# EAGLE design rpi64 (EAGLE 7.1.0)
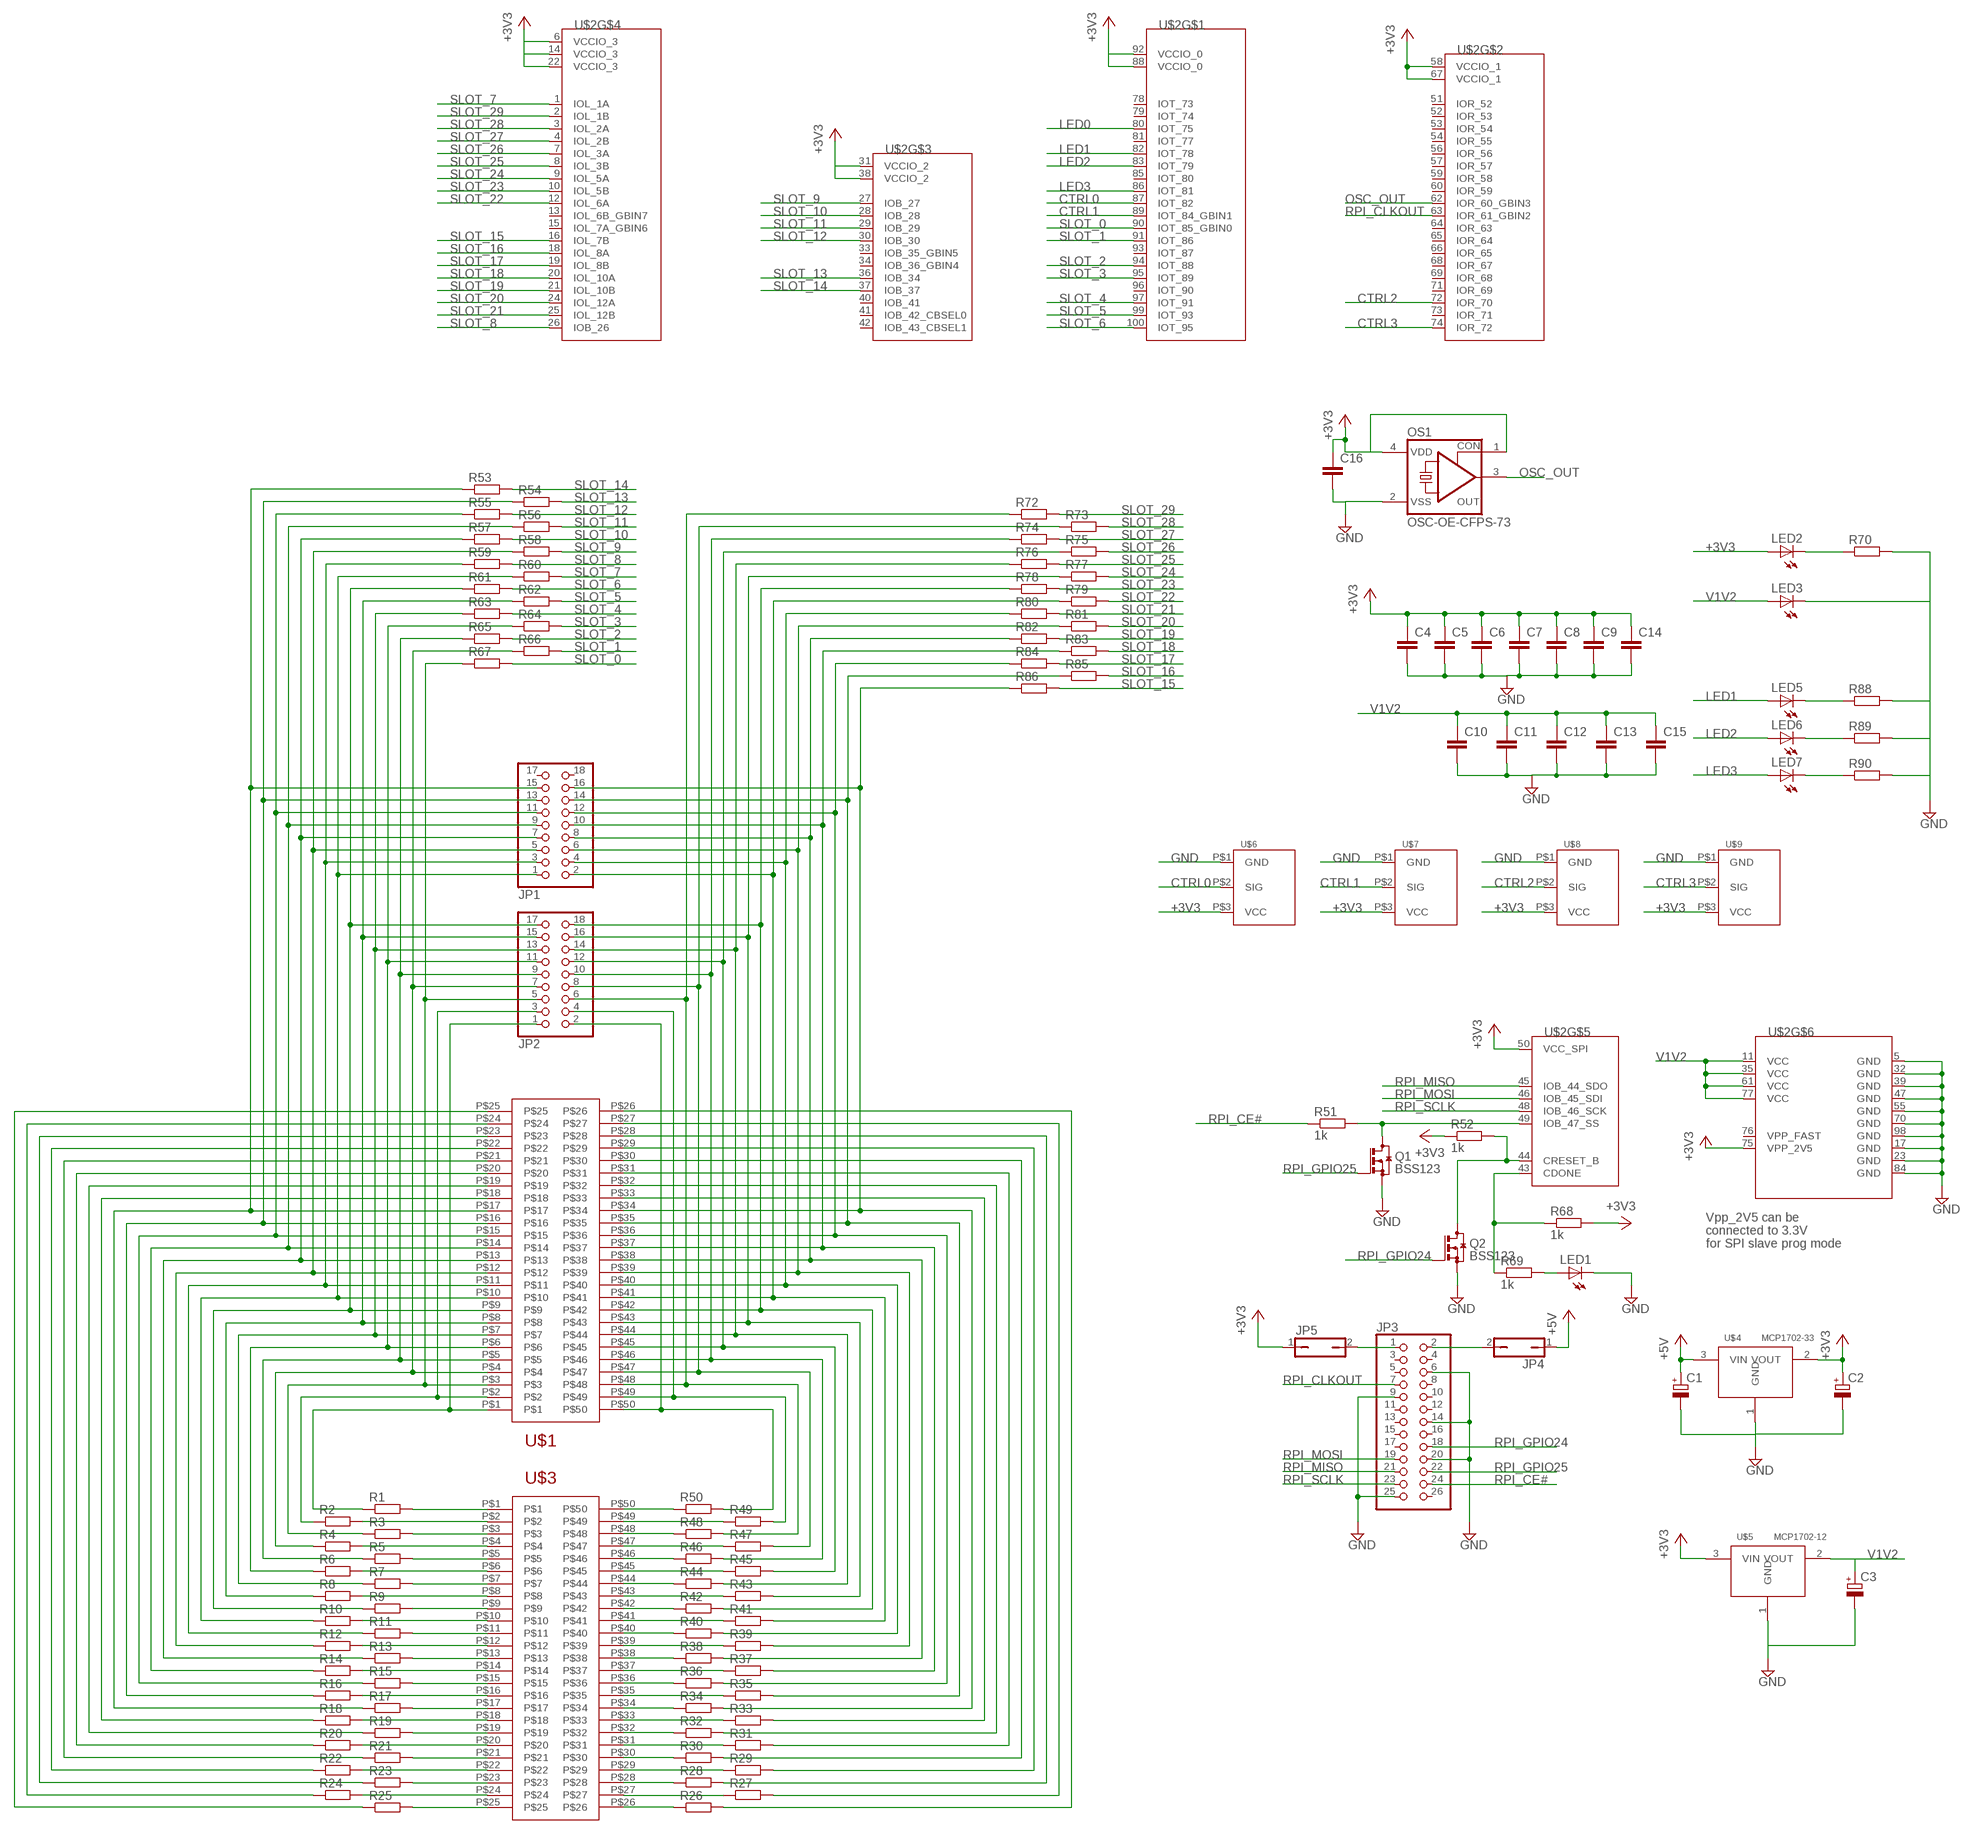
[diagram p0: schematic, sheet 1]

## Parts
C1  CPOL-EUR/2012-12R  [R/2012-12R]
C2  CPOL-EUR/2012-12R  [R/2012-12R]
C3  CPOL-EUR/2012-12R  [R/2012-12R]
C4  C-EUC0805  [C0805]
C5  C-EUC0805  [C0805]
C6  C-EUC0805  [C0805]
C7  C-EUC0805  [C0805]
C8  C-EUC0805  [C0805]
C9  C-EUC0805  [C0805]
C10  C-EUC0805  [C0805]
C11  C-EUC0805  [C0805]
C12  C-EUC0805  [C0805]
C13  C-EUC0805  [C0805]
C14  C-EUC0805  [C0805]
C15  C-EUC0805  [C0805]
C16  C-EUC0805  [C0805]
JP1  PINHD-2X9  [2X09]
JP2  PINHD-2X9  [2X09]
JP3  PINHD-2X13  [2X13]
JP4  JP1Q  [JP1]
JP5  JP1Q  [JP1]
LED1  LEDCHIPLED_0603  [CHIPLED_0603]
LED2  LEDCHIPLED_0603  [CHIPLED_0603]
LED3  LEDCHIPLED_0603  [CHIPLED_0603]
LED5  LEDCHIPLED_0603  [CHIPLED_0603]
LED6  LEDCHIPLED_0603  [CHIPLED_0603]
LED7  LEDCHIPLED_0603  [CHIPLED_0603]
OS1  OSC-OE-CFPS-73  [7.2X5.2-4-PAD]
Q1  BSS123  [SOT23]
Q2  BSS123  [SOT23]
R1  R-EU_R0603  [R0603]
R2  R-EU_R0603  [R0603]
R3  R-EU_R0603  [R0603]
R4  R-EU_R0603  [R0603]
R5  R-EU_R0603  [R0603]
R6  R-EU_R0603  [R0603]
R7  R-EU_R0603  [R0603]
R8  R-EU_R0603  [R0603]
R9  R-EU_R0603  [R0603]
R10  R-EU_R0603  [R0603]
R11  R-EU_R0603  [R0603]
R12  R-EU_R0603  [R0603]
R13  R-EU_R0603  [R0603]
R14  R-EU_R0603  [R0603]
R15  R-EU_R0603  [R0603]
R16  R-EU_R0603  [R0603]
R17  R-EU_R0603  [R0603]
R18  R-EU_R0603  [R0603]
R19  R-EU_R0603  [R0603]
R20  R-EU_R0603  [R0603]
R21  R-EU_R0603  [R0603]
R22  R-EU_R0603  [R0603]
R23  R-EU_R0603  [R0603]
R24  R-EU_R0603  [R0603]
R25  R-EU_R0603  [R0603]
R26  R-EU_R0603  [R0603]
R27  R-EU_R0603  [R0603]
R28  R-EU_R0603  [R0603]
R29  R-EU_R0603  [R0603]
R30  R-EU_R0603  [R0603]
R31  R-EU_R0603  [R0603]
R32  R-EU_R0603  [R0603]
R33  R-EU_R0603  [R0603]
R34  R-EU_R0603  [R0603]
R35  R-EU_R0603  [R0603]
R36  R-EU_R0603  [R0603]
R37  R-EU_R0603  [R0603]
R38  R-EU_R0603  [R0603]
R39  R-EU_R0603  [R0603]
R40  R-EU_R0603  [R0603]
R41  R-EU_R0603  [R0603]
R42  R-EU_R0603  [R0603]
R43  R-EU_R0603  [R0603]
R44  R-EU_R0603  [R0603]
R45  R-EU_R0603  [R0603]
R46  R-EU_R0603  [R0603]
R47  R-EU_R0603  [R0603]
R48  R-EU_R0603  [R0603]
R49  R-EU_R0603  [R0603]
R50  R-EU_R0603  [R0603]
R51  1k  R-EU_R0603  [R0603]
R52  1k  R-EU_R0603  [R0603]
R53  R-EU_R0603  [R0603]
R54  R-EU_R0603  [R0603]
R55  R-EU_R0603  [R0603]
R56  R-EU_R0603  [R0603]
R57  R-EU_R0603  [R0603]
R58  R-EU_R0603  [R0603]
R59  R-EU_R0603  [R0603]
R60  R-EU_R0603  [R0603]
R61  R-EU_R0603  [R0603]
R62  R-EU_R0603  [R0603]
R63  R-EU_R0603  [R0603]
R64  R-EU_R0603  [R0603]
R65  R-EU_R0603  [R0603]
R66  R-EU_R0603  [R0603]
R67  R-EU_R0603  [R0603]
R68  1k  R-EU_R0603  [R0603]
R69  1k  R-EU_R0603  [R0603]
R70  R-EU_R0603  [R0603]
R72  R-EU_R0603  [R0603]
R73  R-EU_R0603  [R0603]
R74  R-EU_R0603  [R0603]
R75  R-EU_R0603  [R0603]
R76  R-EU_R0603  [R0603]
R77  R-EU_R0603  [R0603]
R78  R-EU_R0603  [R0603]
R79  R-EU_R0603  [R0603]
R80  R-EU_R0603  [R0603]
R81  R-EU_R0603  [R0603]
R82  R-EU_R0603  [R0603]
R83  R-EU_R0603  [R0603]
R84  R-EU_R0603  [R0603]
R85  R-EU_R0603  [R0603]
R86  R-EU_R0603  [R0603]
R88  R-EU_R0603  [R0603]
R89  R-EU_R0603  [R0603]
R90  R-EU_R0603  [R0603]
U$1  5530843-5  [5530843-3]
U$2  ICE40HX1KVQ100  [VQ100]
U$3  EDGE50  [EDGE50]
U$4  MCP1702-33  MCP1702  [SOT23A]
U$5  MCP1702-12  MCP1702  [SOT23A]
U$6  N64_CONTROLER  [N64_CONTROLER]
U$7  N64_CONTROLER  [N64_CONTROLER]
U$8  N64_CONTROLER  [N64_CONTROLER]
U$9  N64_CONTROLER  [N64_CONTROLER]

## Nets
+3V3: C2.+ C4.1 C5.1 C6.1 C7.1 C8.1 C9.1 C14.1 C16.1 JP5.1 LED2.A OS1.1(CON) OS1.4(VDD) R52.1 R68.2 U$2.6(VCCIO_3) U$2.14(VCCIO_3) U$2.22(VCCIO_3) U$2.31(VCCIO_2) U$2.38(VCCIO_2) U$2.50(VCC_SPI) U$2.58(VCCIO_1) U$2.67(VCCIO_1) U$2.75(VPP_2V5) U$2.88(VCCIO_0) U$2.92(VCCIO_0) U$4.2(VOUT) U$5.3(VIN) U$6.P$3(VCC) U$7.P$3(VCC) U$8.P$3(VCC) U$9.P$3(VCC)
+5V: C1.+ JP4.1 U$4.3(VIN)
CTRL0: U$2.87(IOT_82) U$6.P$2(SIG)
CTRL1: U$2.89(IOT_84_GBIN1) U$7.P$2(SIG)
CTRL2: U$2.72(IOR_70) U$8.P$2(SIG)
CTRL3: U$2.74(IOR_72) U$9.P$2(SIG)
GND: C1.- C2.- C3.- C4.2 C5.2 C6.2 C7.2 C8.2 C9.2 C10.2 C11.2 C12.2 C13.2 C14.2 C15.2 C16.2 JP3.6 JP3.9 JP3.14 JP3.20 JP3.25 LED1.C LED3.C OS1.2(VSS) Q1.2(S) Q2.2(S) R70.2 R88.2 R89.2 R90.2 U$2.5(GND) U$2.17(GND) U$2.23(GND) U$2.32(GND) U$2.39(GND) U$2.47(GND) U$2.55(GND) U$2.70(GND) U$2.84(GND) U$2.98(GND) U$4.1(GND) U$5.1(GND) U$6.P$1(GND) U$7.P$1(GND) U$8.P$1(GND) U$9.P$1(GND)
LED0: U$2.80(IOT_75)
LED1: LED5.A U$2.82(IOT_78)
LED2: LED6.A U$2.83(IOT_79)
LED3: LED7.A U$2.86(IOT_81)
N$1: R1.2 U$3.P$1
N$2: R2.2 U$3.P$2
N$3: R3.2 U$3.P$3
N$4: R4.2 U$3.P$4
N$5: R5.2 U$3.P$5
N$6: R6.2 U$3.P$6
N$7: R7.2 U$3.P$7
N$8: R8.2 U$3.P$8
N$9: R9.2 U$3.P$9
N$10: R10.2 U$3.P$10
N$11: R11.2 U$3.P$11
N$12: R12.2 U$3.P$12
N$13: R13.2 U$3.P$13
N$14: R14.2 U$3.P$14
N$15: R15.2 U$3.P$15
N$16: R16.2 U$3.P$16
N$17: R17.2 U$3.P$17
N$18: R18.2 U$3.P$18
N$19: R19.2 U$3.P$19
N$20: R20.2 U$3.P$20
N$21: R21.2 U$3.P$21
N$22: R22.2 U$3.P$22
N$23: R23.2 U$3.P$23
N$24: R24.2 U$3.P$24
N$25: R25.2 U$3.P$25
N$26: R26.1 U$3.P$26
N$27: R27.1 U$3.P$27
N$28: R28.1 U$3.P$28
N$29: R29.1 U$3.P$29
N$30: R30.1 U$3.P$30
N$31: R31.1 U$3.P$31
N$32: R32.1 U$3.P$32
N$33: R33.1 U$3.P$33
N$34: R34.1 U$3.P$34
N$35: R35.1 U$3.P$35
N$36: R36.1 U$3.P$36
N$37: R37.1 U$3.P$37
N$38: R38.1 U$3.P$38
N$39: R39.1 U$3.P$39
N$40: R40.1 U$3.P$40
N$41: R41.1 U$3.P$41
N$42: R42.1 U$3.P$42
N$43: R43.1 U$3.P$43
N$44: R44.1 U$3.P$44
N$45: R45.1 U$3.P$45
N$46: R46.1 U$3.P$46
N$47: R47.1 U$3.P$47
N$48: R48.1 U$3.P$48
N$49: R49.1 U$3.P$49
N$50: R50.1 U$3.P$50
N$51: JP2.1 R1.1 U$1.P$1
N$52: JP2.3 R2.1 U$1.P$2
N$53: JP2.5 R3.1 R67.1 U$1.P$3
N$54: JP2.7 R4.1 R66.1 U$1.P$4
N$55: JP2.9 R5.1 R65.1 U$1.P$5
N$56: JP2.11 R6.1 R64.1 U$1.P$6
N$57: JP2.13 R7.1 R63.1 U$1.P$7
N$58: JP2.15 R8.1 R62.1 U$1.P$8
N$59: JP2.17 R9.1 R61.1 U$1.P$9
N$60: JP1.1 R10.1 R60.1 U$1.P$10
N$61: JP1.3 R11.1 R59.1 U$1.P$11
N$62: JP1.5 R12.1 R58.1 U$1.P$12
N$63: JP1.7 R13.1 R57.1 U$1.P$13
N$64: JP1.9 R14.1 R56.1 U$1.P$14
N$65: JP1.11 R15.1 R55.1 U$1.P$15
N$66: JP1.13 R16.1 R54.1 U$1.P$16
N$67: JP1.15 R17.1 R53.1 U$1.P$17
N$68: R18.1 U$1.P$18
N$69: R19.1 U$1.P$19
N$70: R20.1 U$1.P$20
N$71: R21.1 U$1.P$21
N$72: R22.1 U$1.P$22
N$73: R23.1 U$1.P$23
N$74: R24.1 U$1.P$24
N$75: R25.1 U$1.P$25
N$76: JP2.4 R49.2 U$1.P$49
N$77: JP2.2 R50.2 U$1.P$50
N$78: JP2.6 R48.2 R72.1 U$1.P$48
N$79: JP2.8 R47.2 R73.1 U$1.P$47
N$80: JP2.10 R46.2 R74.1 U$1.P$46
N$81: JP2.12 R45.2 R75.1 U$1.P$45
N$82: JP2.14 R44.2 R76.1 U$1.P$44
N$83: JP2.16 R43.2 R77.1 U$1.P$43
N$84: JP2.18 R42.2 R78.1 U$1.P$42
N$85: JP1.2 R41.2 R79.1 U$1.P$41
N$86: JP1.4 R40.2 R80.1 U$1.P$40
N$87: JP1.6 R39.2 R81.1 U$1.P$39
N$88: JP1.8 R38.2 R82.1 U$1.P$38
N$89: JP1.10 R37.2 R83.1 U$1.P$37
N$90: JP1.12 R36.2 R84.1 U$1.P$36
N$91: R68.1 R69.1 U$2.43(CDONE)
N$92: JP1.16 R34.2 R86.1 U$1.P$34
N$93: R33.2 U$1.P$33
N$94: R32.2 U$1.P$32
N$95: R31.2 U$1.P$31
N$96: R30.2 U$1.P$30
N$97: R29.2 U$1.P$29
N$98: R28.2 U$1.P$28
N$99: R27.2 U$1.P$27
N$100: R26.2 U$1.P$26
N$101: JP3.1 JP5.2
N$102: JP3.2 JP4.2
N$103: Q2.3(D) R52.2 U$2.44(CRESET_B)
N$104: LED1.A R69.2
N$105: JP1.14 R35.2 R85.1 U$1.P$35
N$106: Q1.3(D) R51.2 U$2.49(IOB_47_SS)
N$107: LED7.C R90.1
N$109: LED6.C R89.1
N$111: LED5.C R88.1
N$116: LED2.C R70.1
OSC_OUT: OS1.3(OUT) U$2.62(IOR_60_GBIN3)
RPI_CE#: JP3.24 R51.1
RPI_CLKOUT: JP3.7 U$2.63(IOR_61_GBIN2)
RPI_GPIO24: JP3.18 Q2.1(G)
RPI_GPIO25: JP3.22 Q1.1(G)
RPI_MISO: JP3.21 U$2.45(IOB_44_SDO)
RPI_MOSI: JP3.19 U$2.46(IOB_45_SDI)
RPI_SCLK: JP3.23 U$2.48(IOB_46_SCK)
SLOT_0: R67.2 U$2.90(IOT_85_GBIN0)
SLOT_1: R66.2 U$2.91(IOT_86)
SLOT_2: R65.2 U$2.94(IOT_88)
SLOT_3: R64.2 U$2.95(IOT_89)
SLOT_4: R63.2 U$2.97(IOT_91)
SLOT_5: R62.2 U$2.99(IOT_93)
SLOT_6: R61.2 U$2.100(IOT_95)
SLOT_7: R60.2 U$2.1(IOL_1A)
SLOT_8: R59.2 U$2.26(IOB_26)
SLOT_9: R58.2 U$2.27(IOB_27)
SLOT_10: R57.2 U$2.28(IOB_28)
SLOT_11: R56.2 U$2.29(IOB_29)
SLOT_12: R55.2 U$2.30(IOB_30)
SLOT_13: R54.2 U$2.36(IOB_34)
SLOT_14: R53.2 U$2.37(IOB_37)
SLOT_15: R86.2 U$2.16(IOL_7B)
SLOT_16: R85.2 U$2.18(IOL_8A)
SLOT_17: R84.2 U$2.19(IOL_8B)
SLOT_18: R83.2 U$2.20(IOL_10A)
SLOT_19: R82.2 U$2.21(IOL_10B)
SLOT_20: R81.2 U$2.24(IOL_12A)
SLOT_21: R80.2 U$2.25(IOL_12B)
SLOT_22: R79.2 U$2.12(IOL_6A)
SLOT_23: R78.2 U$2.10(IOL_5B)
SLOT_24: R77.2 U$2.9(IOL_5A)
SLOT_25: R76.2 U$2.8(IOL_3B)
SLOT_26: R75.2 U$2.7(IOL_3A)
SLOT_27: R74.2 U$2.4(IOL_2B)
SLOT_28: R73.2 U$2.3(IOL_2A)
SLOT_29: R72.2 U$2.2(IOL_1B)
V1V2: C3.+ C10.1 C11.1 C12.1 C13.1 C15.1 LED3.A U$2.11(VCC) U$2.35(VCC) U$2.61(VCC) U$2.77(VCC) U$5.2(VOUT)
Unconnected: JP1.17 JP1.18 JP3.3 JP3.4 JP3.5 JP3.8 JP3.10 JP3.11 JP3.12 JP3.13 JP3.15 JP3.16 JP3.17 JP3.26 U$2.13(IOL_6B_GBIN7) U$2.15(IOL_7A_GBIN6) U$2.33(IOB_35_GBIN5) U$2.34(IOB_36_GBIN4) U$2.40(IOB_41) U$2.41(IOB_42_CBSEL0) U$2.42(IOB_43_CBSEL1) U$2.51(IOR_52) U$2.52(IOR_53) U$2.53(IOR_54) U$2.54(IOR_55) U$2.56(IOR_56) U$2.57(IOR_57) U$2.59(IOR_58) U$2.60(IOR_59) U$2.64(IOR_63) U$2.65(IOR_64) U$2.66(IOR_65) U$2.68(IOR_67) U$2.69(IOR_68) U$2.71(IOR_69) U$2.73(IOR_71) U$2.78(IOT_73) U$2.79(IOT_74) U$2.81(IOT_77) U$2.85(IOT_80) U$2.93(IOT_87) U$2.96(IOT_90)

## Notes on the sheet
- Vpp_2V5 can be 
  connected to 3.3V 
  for SPI slave prog mode

## Power pins joined to a net without a drawn wire
VPP_FAST: U$2.76(VPP_FAST)

## Library data of the parts
C1-C3 = resistor:CPOL-EU: POLARIZED CAPACITOR, European symbol
C4-C16 = rcl:C-EU: CAPACITOR, European symbol
JP1 JP2 = pinhead:PINHD-2X9: PIN HEADER
JP3 = pinhead:PINHD-2X13: PIN HEADER
JP4 JP5 = jumper:JP1Q: JUMPER
LED1-LED3 LED5-LED7 = led:LED: LED OSRAM: - CHIPLED LG R971, LG N971, LY N971, LG Q971, LY Q971, LO R971, LY R971 LH N974, LH R974 LS Q976, LO Q976, LY Q976 LO Q996 - Hyper CHIPLED LW Q18S LB Q993, LB Q99A, LB R99A - SideLED LS A670, LO A670, LY A670, LG A670, LP A670 LB A673, LV A673, LT A673, LW A673 LH A674 LY A675 LS A676, LA A676, LO A676, LY A676, LW A676 LS A679, LY A679, LG A679 - Hyper Micro SIDELED® LS Y876, LA Y876, LO Y876, LY Y876 LT Y87S - SmartLED LW L88C, LW L88S LB L89C, LB L89S, LG L890 LS L89K, LO L89K, LY L89K LS L896, LA L896, LO L896, LY L896 - TOPLED LS T670, LO T670, LY T670, LG T670, LP T670 LSG T670, LSP T670, LSY T670, LOP T670, LYG T670 LG T671, LOG T671, LSG T671 LB T673, LV T673, LT T673, LW T673 LH T674 LS T676, LA T676, LO T676, LY T676, LB T676, LH T676, LSB T676, LW T676 LB T67C, LV T67C, LT T67C, LS T67K, LO T67K, LY T67K, LW E67C LS E67B, LA E67B, LO E67B, LY E67B, LB E67C, LV E67C, LT E67C LW T67C LS T679, LY T679, LG T679 LS T770, LO T770, LY T770, LG T770, LP T770 LB T773, LV T773, LT T773, LW T773 LH T774 LS E675, LA E675, LY E675, LS T675 LS T776, LA T776, LO T776, LY T776, LB T776 LHGB T686 LT T68C, LB T68C - Hyper Mini TOPLED® LB M676 - Mini TOPLED Santana® LG M470 LS M47K, LO M47K, LY M47K Source: http://www.osram.convergy.de LUXEON: - LUMILED® LXK2-PW12-R00, LXK2-PW12-S00, LXK2-PW14-U00, LXK2-PW14-V00 LXK2-PM12-R00, LXK2-PM12-S00, LXK2-PM14-U00 LXK2-PE12-Q00, LXK2-PE12-R00, LXK2-PE12-S00, LXK2-PE14-T00, LXK2-PE14-U00 LXK2-PB12-K00, LXK2-PB12-L00, LXK2-PB12-M00, LXK2-PB14-N00, LXK2-PB14-P00, LXK2-PB14-Q00 LXK2-PR12-L00, LXK2-PR12-M00, LXK2-PR14-Q00, LXK2-PR14-R00 LXK2-PD12-Q00, LXK2-PD12-R00, LXK2-PD12-S00 LXK2-PH12-R00, LXK2-PH12-S00 LXK2-PL12-P00, LXK2-PL12-Q00, LXK2-PL12-R00 Source: www.luxeon.com KINGBRIGHT: KA-3528ASYC Source: www.kingbright.com
OS1 = IQD-Frequency-Products:OSC-OE: OSCILLATOR WITH OE
Q1 Q2 = transistor-small-signal:BSS123: N-CHANNEL MOS FET
R1-R70 R72-R86 R88-R90 = rcl:R-EU_: RESISTOR, European symbol
U$1 = rpi64:5530843-5
U$2 = rpi64:ICE40HX1KVQ100
U$3 = rpi64:EDGE50
U$4 U$5 = rpi64:MCP1702
U$6-U$9 = rpi64:N64_CONTROLER

## Board
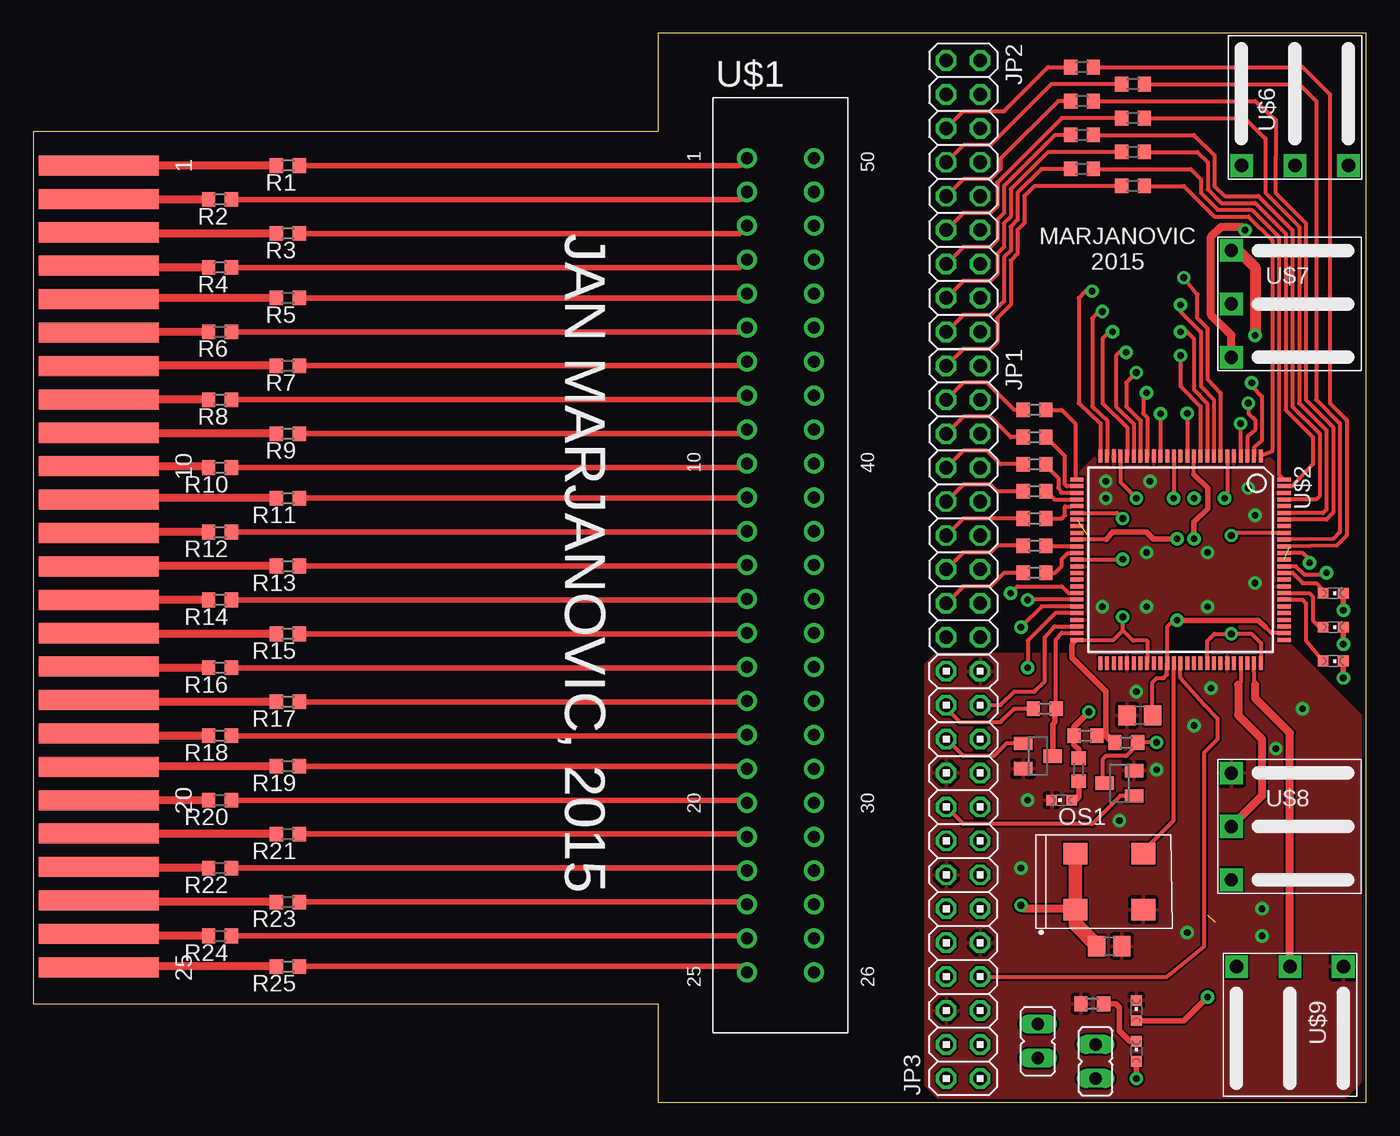
[diagram p1: board, top side]
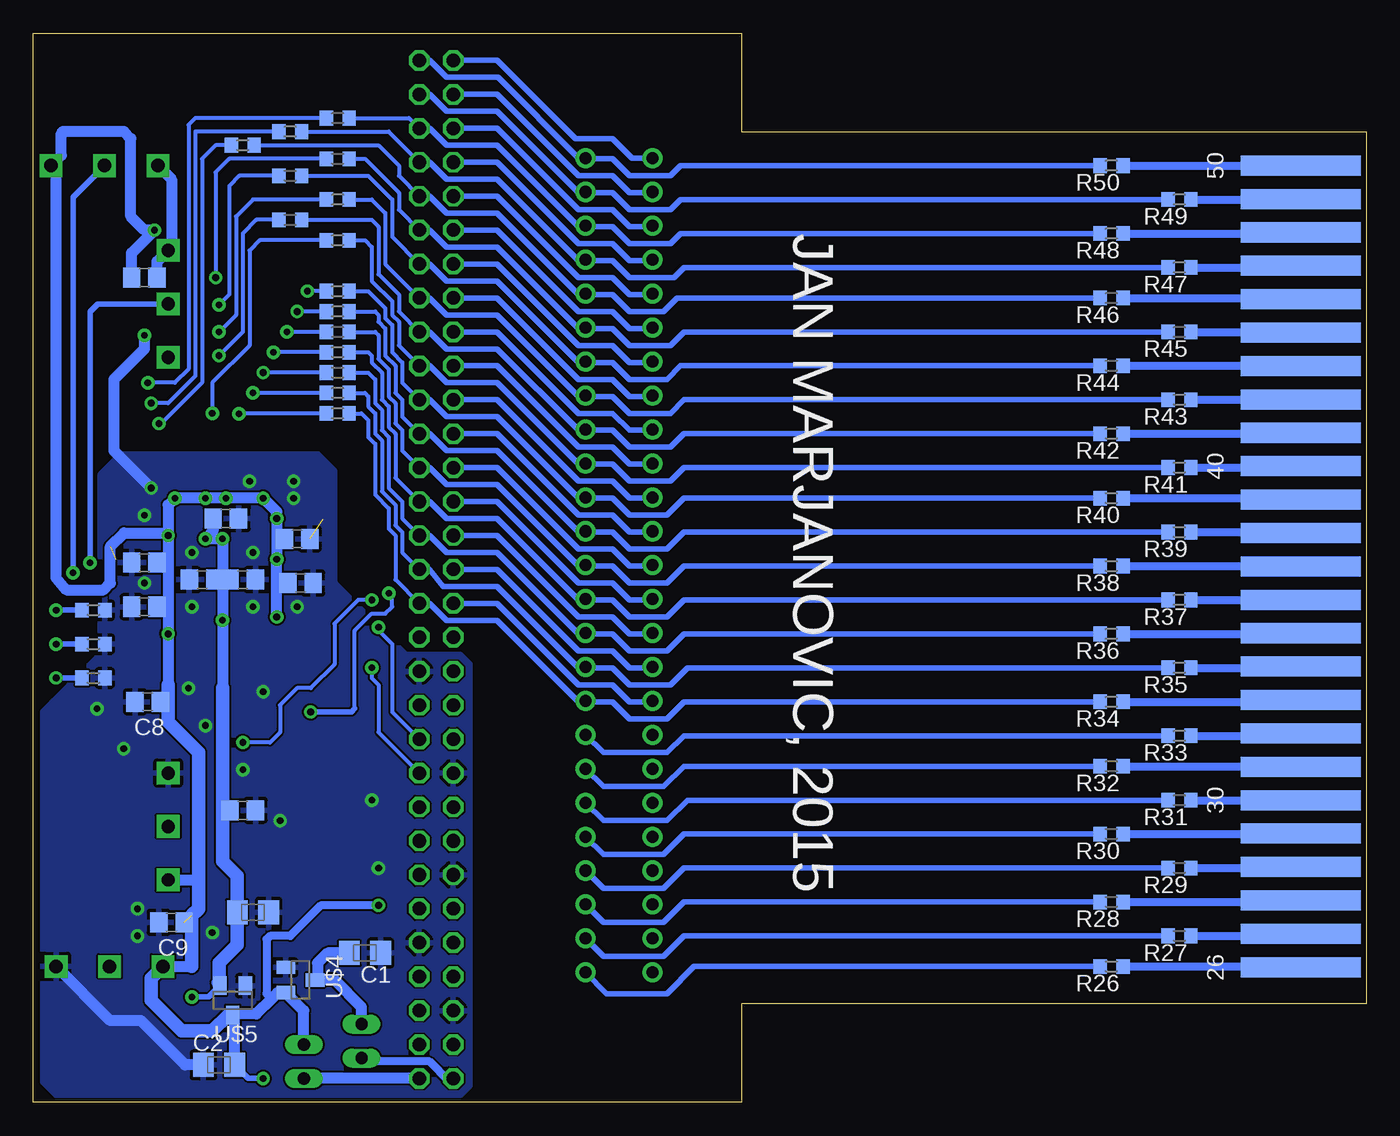
[diagram p2: board, bottom side, seen from below]

Size 99.75 x 80 mm. Coordinates in mm from the lower left corner, seen from the top.
Outline: 46.74,0 99.75,0 99.75,80 46.74,80 46.74,72.64 0,72.64 0,7.37 46.74,7.37 46.74,0
Copper layers (1*16): Top 0.035mm / dielectric 1.5mm / Bottom 0.035mm
Design rules "SeeedStudio_2layer_DRU_no_angle_20140221": minimum track width 6mil, minimum drill 12mil, track to track 6mil, track to pad 6mil, pad to pad 6mil, via to via 6mil, smd to smd 0mil, copper to edge 10mil, drill to drill 10mil, minimum pad ring 10mil, minimum via ring 6mil, stop-mask expansion 2mil, vias tented up to drill 100mil, thermal gap 10mil

### Footprints (pad centres in the part's own frame; a part is rotated, then mirrored left to right if it is on the bottom)
R/2012-12R = smd 1.55 x 1.8: + 1.175,0; - -1.175,0
C0805 = smd 1.3 x 1.5: 1 -0.95,0; 2 0.95,0
2X09 = drill 1.016 octagon: 1 -10.16,-1.27; 2 -10.16,1.27; 3 -7.62,-1.27; 4 -7.62,1.27; 5 -5.08,-1.27; 6 -5.08,1.27; 7 -2.54,-1.27; 8 -2.54,1.27; 9 0,-1.27; 10 0,1.27; 11 2.54,-1.27; 12 2.54,1.27; 13 5.08,-1.27; 14 5.08,1.27; 15 7.62,-1.27; 16 7.62,1.27; 17 10.16,-1.27; 18 10.16,1.27
2X13 = drill 1.016 octagon: 1 -15.24,-1.27; 2 -15.24,1.27; 3 -12.7,-1.27; 4 -12.7,1.27; 5 -10.16,-1.27; 6 -10.16,1.27; 7 -7.62,-1.27; 8 -7.62,1.27; 9 -5.08,-1.27; 10 -5.08,1.27; 11 -2.54,-1.27; 12 -2.54,1.27; 13 0,-1.27; 14 0,1.27; 15 2.54,-1.27; 16 2.54,1.27; 17 5.08,-1.27; 18 5.08,1.27; 19 7.62,-1.27; 20 7.62,1.27; 21 10.16,-1.27; 22 10.16,1.27; 23 12.7,-1.27; 24 12.7,1.27; 25 15.24,-1.27; 26 15.24,1.27
JP1 = drill 0.914 long: 1 0,-1.27; 2 0,1.27
CHIPLED_0603 = smd 0.8 x 0.8: A 0,-0.75; C 0,0.75
7.2X5.2-4-PAD = smd 1.8 x 1.6: 1 -2.54,-2.1; 2 2.54,-2.1; 3 2.54,2.1; 4 -2.54,2.1
SOT23 = smd 1 x 1.4: 1 -0.95,-1.1; 2 0.95,-1.1; 3 0,1.1
R0603 = smd 1 x 1.1: 1 -0.85,0; 2 0.85,0
5530843-3 = drill 0.9 pad 1.5: P$1 4.51,-7.54; P$2 7.05,-7.54; P$3 9.59,-7.54; P$4 12.13,-7.54; P$5 14.67,-7.54; P$6 17.21,-7.54; P$7 19.75,-7.54; P$8 22.29,-7.54; P$9 24.83,-7.54; P$10 27.37,-7.54; P$11 29.91,-7.54; P$12 32.45,-7.54; P$13 34.99,-7.54; P$14 37.53,-7.54; P$15 40.07,-7.54; P$16 42.61,-7.54; P$17 45.15,-7.54; P$18 47.69,-7.54; P$19 50.23,-7.54; P$20 52.77,-7.54; P$21 55.31,-7.54; P$22 57.85,-7.54; P$23 60.39,-7.54; P$24 62.93,-7.54; P$25 65.47,-7.54; P$26 65.47,-2.54; P$27 62.93,-2.54; P$28 60.39,-2.54; P$29 57.85,-2.54; P$30 55.31,-2.54; P$31 52.77,-2.54; P$32 50.23,-2.54; P$33 47.69,-2.54; P$34 45.15,-2.54; P$35 42.61,-2.54; P$36 40.07,-2.54; P$37 37.53,-2.54; P$38 34.99,-2.54; P$39 32.45,-2.54; P$40 29.91,-2.54; P$41 27.37,-2.54; P$42 24.83,-2.54; P$43 22.29,-2.54; P$44 19.75,-2.54; P$45 17.21,-2.54; P$46 14.67,-2.54; P$47 12.13,-2.54; P$48 9.59,-2.54; P$49 7.05,-2.54; P$50 4.51,-2.54
VQ100 = smd 1 x 0.3: 1 -7.75,6; 2 -7.75,5.5; 3 -7.75,5; 4 -7.75,4.5; 5 -7.75,4; 6 -7.75,3.5; 7 -7.75,3; 8 -7.75,2.5; 9 -7.75,2; 10 -7.75,1.5; 11 -7.75,1; 12 -7.75,0.5; 13 -7.75,0; 14 -7.75,-0.5; 15 -7.75,-1; 16 -7.75,-1.5; 17 -7.75,-2; 18 -7.75,-2.5; 19 -7.75,-3; 20 -7.75,-3.5; 21 -7.75,-4; 22 -7.75,-4.5; 23 -7.75,-5; 24 -7.75,-5.5; 25 -7.75,-6; 51 7.75,-6; 52 7.75,-5.5; 53 7.75,-5; 54 7.75,-4.5; 55 7.75,-4; 56 7.75,-3.5; 57 7.75,-3; 58 7.75,-2.5; 59 7.75,-2; 60 7.75,-1.5; 61 7.75,-1; 62 7.75,-0.5; 63 7.75,0; 64 7.75,0.5; 65 7.75,1; 66 7.75,1.5; 67 7.75,2; 68 7.75,2.5; 69 7.75,3; 70 7.75,3.5; 71 7.75,4; 72 7.75,4.5; 73 7.75,5; 74 7.75,5.5; 75 7.75,6 | smd 0.3 x 1: 26 -6,-7.75; 27 -5.5,-7.75; 28 -5,-7.75; 29 -4.5,-7.75; 30 -4,-7.75; 31 -3.5,-7.75; 32 -3,-7.75; 33 -2.5,-7.75; 34 -2,-7.75; 35 -1.5,-7.75; 36 -1,-7.75; 37 -0.5,-7.75; 38 0,-7.75; 39 0.5,-7.75; 40 1,-7.75; 41 1.5,-7.75; 42 2,-7.75; 43 2.5,-7.75; 44 3,-7.75; 45 3.5,-7.75; 46 4,-7.75; 47 4.5,-7.75; 48 5,-7.75; 49 5.5,-7.75; 50 6,-7.75; 76 6,7.75; 77 5.5,7.75; 78 5,7.75; 79 4.5,7.75; 80 4,7.75; 81 3.5,7.75; 82 3,7.75; 83 2.5,7.75; 84 2,7.75; 85 1.5,7.75; 86 1,7.75; 87 0.5,7.75; 88 0,7.75; 89 -0.5,7.75; 90 -1,7.75; 91 -1.5,7.75; 92 -2,7.75; 93 -2.5,7.75; 94 -3,7.75; 95 -3.5,7.75; 96 -4,7.75; 97 -4.5,7.75; 98 -5,7.75; 99 -5.5,7.75; 100 -6,7.75
EDGE50 = smd 1.5 x 9: P$1 0,4.754; P$2 2.5,4.754; P$3 5,4.754; P$4 7.5,4.754; P$5 10,4.754; P$6 12.5,4.754; P$7 15,4.754; P$8 17.5,4.754; P$9 20,4.754; P$10 22.5,4.754; P$11 25,4.754; P$12 27.5,4.754; P$13 30,4.754; P$14 32.5,4.754; P$15 35,4.754; P$16 37.5,4.754; P$17 40,4.754; P$18 42.5,4.754; P$19 45,4.754; P$20 47.5,4.754; P$21 50,4.754; P$22 52.5,4.754; P$23 55,4.754; P$24 57.5,4.754; P$25 60,4.754 | smd 1.5 x 9 bottom: P$26 60,4.754; P$27 57.5,4.754; P$28 55,4.754; P$29 52.5,4.754; P$30 50,4.754; P$31 47.5,4.754; P$32 45,4.754; P$33 42.5,4.754; P$34 40,4.754; P$35 37.5,4.754; P$36 35,4.754; P$37 32.5,4.754; P$38 30,4.754; P$39 27.5,4.754; P$40 25,4.754; P$41 22.5,4.754; P$42 20,4.754; P$43 17.5,4.754; P$44 15,4.754; P$45 12.5,4.754; P$46 10,4.754; P$47 7.5,4.754; P$48 5,4.754; P$49 2.5,4.754; P$50 0,4.754
SOT23A = smd 1 x 1.4: 1 -0.95,-1.1; 2 0.95,-1.1; 3 0,1.1
N64_CONTROLER = drill 1 pad 1.7 square: P$1 0,0; P$2 0,-4; P$3 0,-8

### Placement (x,y rotation side)
C1  74.93,11.18 180 bottom
C2  85.85,2.79 0 bottom
C3  83.31,14.22 180 bottom
C4  79.76,38.86 0 bottom
C5  80.01,42.16 0 bottom
C6  91.44,40.39 180 bottom
C7  91.44,37.08 180 bottom
C8  91.19,29.97 180 bottom
C9  89.41,13.46 180 bottom
C10  84.07,21.84 0 bottom
C11  82.8,28.96 180 top
C12  84.07,39.12 0 bottom
C13  87.12,39.12 180 bottom
C14  91.44,61.72 0 bottom
C15  85.34,43.69 0 bottom
C16  80.52,11.68 0 top
JP1  69.6,44.96 270 top
JP2  69.6,67.82 270 top
JP3  69.6,17.02 90 top
JP4  75.18,4.57 180 top
JP5  79.5,3.05 180 top
LED1  76.96,22.61 90 top
LED2  82.55,3.81 0 top
LED3  82.55,6.86 0 top
LED5  97.28,33.02 270 top
LED6  97.28,35.56 270 top
LED7  97.28,38.1 270 top
OS1  80.52,16.51 0 top
Q1  75.18,25.91 270 top
Q2  81.28,23.88 90 top
R1  19.05,70.1 180 top
R2  13.97,67.56 180 top
R3  19.05,65.02 180 top
R4  13.97,62.48 180 top
R5  19.05,60.2 180 top
R6  13.97,57.66 180 top
R7  19.05,55.12 180 top
R8  13.97,52.58 180 top
R9  19.05,50.04 180 top
R10  13.97,47.5 180 top
R11  19.05,45.21 180 top
R12  13.97,42.67 180 top
R13  19.05,40.13 180 top
R14  13.97,37.59 180 top
R15  19.05,35.05 180 top
R16  13.97,32.51 180 top
R17  19.05,29.97 180 top
R18  13.97,27.43 180 top
R19  19.05,25.15 180 top
R20  13.97,22.61 180 top
R21  19.05,20.07 180 top
R22  13.97,17.53 180 top
R23  19.05,14.99 180 top
R24  13.97,12.45 180 top
R25  19.05,10.16 180 top
R26  19.05,10.16 180 bottom
R27  13.97,12.45 180 bottom
R28  19.05,14.99 180 bottom
R29  13.97,17.53 180 bottom
R30  19.05,20.07 180 bottom
R31  13.97,22.61 180 bottom
R32  19.05,25.15 180 bottom
R33  13.97,27.43 180 bottom
R34  19.05,29.97 180 bottom
R35  13.97,32.51 180 bottom
R36  19.05,35.05 180 bottom
R37  13.97,37.59 180 bottom
R38  19.05,40.13 180 bottom
R39  13.97,42.67 180 bottom
R40  19.05,45.21 180 bottom
R41  13.97,47.5 180 bottom
R42  19.05,50.04 180 bottom
R43  13.97,52.58 180 bottom
R44  19.05,55.12 180 bottom
R45  13.97,57.66 180 bottom
R46  19.05,60.2 180 bottom
R47  13.97,62.48 180 bottom
R48  19.05,65.02 180 bottom
R49  13.97,67.56 180 bottom
R50  19.05,70.1 180 bottom
R51  75.69,29.46 0 top
R52  81.79,26.92 0 top
R53  74.93,39.62 0 top
R54  74.93,41.66 0 top
R55  74.93,43.69 0 top
R56  74.93,45.72 0 top
R57  74.93,47.75 0 top
R58  74.93,49.78 0 top
R59  74.93,51.82 0 top
R60  82.3,68.58 0 top
R61  78.49,69.85 0 top
R62  82.3,71.12 0 top
R63  78.49,72.39 0 top
R64  82.3,73.66 0 top
R65  78.49,74.93 0 top
R66  82.3,76.2 0 top
R67  78.49,77.47 0 top
R68  78.74,27.43 0 top
R69  78.23,24.89 270 top
R70  79.25,7.37 180 top
R72  76.96,73.66 180 bottom
R73  80.52,72.64 180 bottom
R74  84.07,71.63 180 bottom
R75  76.96,70.61 180 bottom
R76  80.52,69.34 180 bottom
R77  76.96,67.56 180 bottom
R78  80.52,66.04 180 bottom
R79  76.96,64.52 180 bottom
R80  76.96,60.71 180 bottom
R81  76.96,59.18 180 bottom
R82  76.96,57.66 180 bottom
R83  76.96,56.13 180 bottom
R84  76.96,54.61 180 bottom
R85  76.96,53.09 180 bottom
R86  76.96,51.56 180 bottom
R88  95.25,31.75 0 bottom
R89  95.25,34.29 0 bottom
R90  95.25,36.83 0 bottom
U$1  60.96,75.18 270 top
U$2  85.85,40.61 270 top
U$3  0.13,70.1 270 top
U$4  79.76,9.14 270 bottom
U$5  84.84,7.62 180 bottom
U$6  90.42,70.1 90 top
U$7  89.66,63.75 0 top
U$8  89.66,24.64 0 top
U$9  98.04,10.16 270 top

### Tracks (layer width: path | path; a pad name or v marks a point on that pad's centre or on a via)
+3V3  (via drill 0.5 pad 1)  (2 unrouted)
  Top 0.305: 81.53,35.31 80.84,34.61 U$2.50 77.72,34.23 | 81.53,35.31 v81.53,36.32 | U$2.38 81.5,40.61 v81.53,40.64 | U$2.31 81.11,44.11 v81.53,43.69 | U$2.22 81.35,46.41 v82.55,45.21 | U$2.14 v85.35,45.22 v85.34,45.21 | 86.85,45.23 v86.87,45.21 | U$2.6 89.35,45.41 v89.15,45.21 | U$2.92 89.85,42.61 v89.66,42.42 | U$2.67 87.85,34.51 88.39,35.05 v89.66,35.05 91.19,35.05 91.85,34.38 U$2.75 | U$2.58 83.36,32.9 83.36,34.54 82.3,34.54 81.53,35.31
  Top 0.406: LED2.A v82.55,1.78 | R68.2 80.26,27.43 | 80.26,27.43 80.43,27.43 R52.1 80.77,26.92 80.26,27.43 | 80.26,27.43 80.26,30.73 77.72,33.27 77.72,34.23
  Top 0.61: U$7.P$3 89.66,57.4 88.14,58.93 88.14,64.77 88.9,65.53 90.42,65.53 v90.68,65.28 | C16.1 79.57,12.13 78.1,13.59 78.1,14.1 77.72,14.48 74.17,14.48 v73.91,14.73
  Top 1.016: OS1.4 OS1.1 77.98,13.27 C16.1
  Bottom 0.406: v82.55,1.78 83.66,1.78 C2.+
  Bottom 0.61: v73.91,14.73 78.23,14.73 80.52,12.45 82.04,12.45 82.3,12.19 82.3,8.13 81.91,7.75
  Bottom 0.813: JP5.1 79.5,6.84 U$4.2 81.47,8.19 81.91,7.75 83.06,6.6 84.75,6.6 U$5.3 84.68,6.36 C2.+ | v81.53,36.32 81.53,38.86 | 81.53,38.86 v81.53,40.64 81.53,41.91 | v89.66,42.42 89.66,44.7 v89.15,45.21 v86.87,45.21 v85.34,45.21 v82.55,45.21 81.53,44.2 v81.53,43.69 81.53,41.91 | v89.66,42.42 89.66,40.39 | 89.66,40.39 89.66,37.08 | 89.66,37.08 v89.66,35.05 89.66,31.24 | 87.38,16.51 87.5,16.64 U$8.P$3 | U$9.P$3 87.88,10.16 | C14.1 92.39,63.57 v90.68,65.28 91.44,65.28 92.46,66.29 92.46,72.14 92.96,72.64 97.54,72.64 97.66,72.52 97.66,70.87 98.3,70.23 U$6.P$3 98.04,69.72 98.04,39.24 97.28,38.35 94.49,38.35 93.98,38.86 93.98,41.59 92.96,42.61 89.85,42.61 v89.66,42.42 | C4.1 81.53,38.86 | C5.1 81.28,42.16 81.53,41.91 | C6.1 89.66,40.39 | C7.1 89.66,37.08 | C8.1 89.92,29.97 89.66,30.23
  Bottom 1.016: U$5.3 85.17,6.52 86.36,5.33 88.65,5.33 90.93,7.62 90.93,9.27 U$9.P$3 | 87.88,10.16 87.88,13.97 87.38,14.48 87.38,16.51 87.38,26.16 89.66,28.45 89.66,30.23 89.66,31.24
+5V
  Bottom 0.813: JP4.1 75.18,7.11 77.22,9.14 U$4.3 78.49,9.31 78.49,10.41 77.72,11.18 C1.+
CTRL0  (via drill 0.5 pad 1)
  Top 0.305: U$2.87 93.62,40.11 94.49,40.11 95.12,39.5 96.65,39.5 v96.77,39.62
  Bottom 0.406: U$6.P$2 96.77,67.75 v96.77,39.62
CTRL1  (via drill 0.5 pad 1)
  Top 0.305: v95.5,40.39 95.5,40.64 95.02,41.1 93.67,41.1 U$2.89
  Bottom 0.406: U$7.P$2 94.93,59.75 95.5,59.18 v95.5,40.39
CTRL2
  Top 0.305: U$2.72 90.35,31.43 90.17,31.24
  Top 0.61: 90.17,31.24 90.17,28.96 91.95,27.18 91.95,22.92 U$8.P$2
CTRL3
  Top 0.305: 91.44,31.24 91.36,31.58 U$2.74
  Top 0.61: U$9.P$2 94.04,27.62 91.44,30.23 91.44,31.24
GND  (via drill 0.5 pad 1)  (1 unrouted)
  Top 0.61: OS1.2 83.06,14.22 82.8,14.22 83.06,14.48
  Top 0.813: U$7.P$1 90.17,63.75 91.44,62.48 v91.44,57.4
  Bottom 0.813: U$6.P$1 89.41,69.09 89.41,64.01 U$7.P$1 90.49,62.93 C14.2 | v91.44,57.4 91.44,56.39 93.73,54.1 93.73,48.77 v90.93,45.97 | C2.- 88.39,2.79 91.69,6.1 93.98,6.1 U$9.P$1
  other vias: 80.26,45.21 80.26,46.48 83.57,46.48 83.31,41.15 83.31,37.08 87.88,41.15 87.88,37.08 91.44,43.94 91.44,38.86 88.14,30.99 82.55,30.73 80.01,37.08 91.95,14.48 91.95,12.45 86.36,12.7 86.87,28.19 73.91,17.53 84.07,24.89 81.28,21.08 74.42,22.61 95,29.46 92.99,26.47
  pour Bottom: 67.06,1.27 67.82,0.51 98.04,0.51 99.06,1.52 99.06,29.21 94.74,33.53 94.74,46.99 93.22,48.51 78.49,48.51 77.22,47.24 77.22,38.86 71.88,33.53 67.82,33.53 67.06,32.77
  pour Top: 77.72,46.48 77.72,33.78 77.47,33.53 67.56,33.53 67.31,33.27 66.8,32.77 66.8,1.27 67.82,0.25 98.04,0.25 99.31,1.52 99.31,28.96 93.98,34.29 93.98,46.74 91.95,48.77 80.01,48.77
LED1
  Top 0.305: U$2.82 94.98,37.61 95.25,37.34 95.25,34.54 96.52,33.02 96.52,33.03 LED5.A
LED2
  Top 0.305: U$2.83 95.49,38.11 95.76,37.85 95.76,36.07 96.52,35.31 96.52,35.57 LED6.A
LED3
  Top 0.305: U$2.86 94.25,39.61 95,38.86 96.01,38.86 96.52,38.35 96.52,38.11 LED7.A
N$1
  Top 0.61: R1.2 U$3.P$1
N$2
  Top 0.61: R2.2 4.54,67.56 U$3.P$2
N$3
  Top 0.61: R3.2 4.58,65.02 U$3.P$3
N$4
  Top 0.61: R4.2 4.62,62.48 U$3.P$4
N$5
  Top 0.61: R5.2 4.59,60.2 U$3.P$5
N$6
  Top 0.61: R6.2 4.55,57.66 U$3.P$6
N$7
  Top 0.61: R7.2 4.51,55.12 U$3.P$7
N$8
  Top 0.61: R8.2 4.53,52.58 U$3.P$8
N$9
  Top 0.61: R9.2 5.33,50.04 5.08,50.29 4.69,50.29 U$3.P$9
N$10
  Top 0.61: U$3.P$10 13.01,47.6 R10.2
N$11
  Top 0.61: R11.2 4.61,45.21 U$3.P$11
N$12
  Top 0.61: R12.2 4.57,42.67 U$3.P$12
N$13
  Top 0.61: R13.2 4.53,40.13 U$3.P$13
N$14
  Top 0.61: 13.21,37.59 R14.2 4.51,37.59 U$3.P$14
N$15
  Top 0.61: R15.2 4.55,35.05 U$3.P$15
N$16
  Top 0.61: R16.2 4.59,32.51 U$3.P$16
N$17
  Top 0.61: R17.2 4.63,29.97 U$3.P$17
N$18
  Top 0.61: R18.2 4.67,27.43 U$3.P$18
N$19
  Top 0.61: R19.2 4.54,25.15 U$3.P$19
N$20
  Top 0.61: R20.2 4.5,22.61 U$3.P$20
N$21
  Top 0.61: R21.2 4.54,20.07 U$3.P$21
N$22
  Top 0.61: R22.2 4.58,17.53 U$3.P$22
N$23
  Top 0.61: R23.2 4.62,14.99 U$3.P$23
N$24
  Top 0.61: R24.2 4.32,12.45 4.06,12.19 4.09,12.19 U$3.P$24
N$25
  Top 0.61: R25.2 4.56,10.16 U$3.P$25
N$26
  Bottom 0.61: R26.1 4.56,10.16 U$3.P$26
N$27
  Bottom 0.61: R27.1 4.66,12.45 U$3.P$27
N$28
  Bottom 0.61: R28.1 4.62,14.99 U$3.P$28
N$29
  Bottom 0.61: R29.1 4.58,17.53 U$3.P$29
N$30
  Bottom 0.61: R30.1 4.54,20.07 U$3.P$30
N$31
  Bottom 0.61: R31.1 4.5,22.61 U$3.P$31
N$32
  Bottom 0.61: R32.1 4.54,25.15 U$3.P$32
N$33
  Bottom 0.61: R33.1 4.67,27.43 U$3.P$33
N$34
  Bottom 0.61: R34.1 4.63,29.97 U$3.P$34
N$35
  Bottom 0.61: R35.1 4.59,32.51 U$3.P$35
N$36
  Bottom 0.61: R36.1 4.55,35.05 U$3.P$36
N$37
  Bottom 0.61: R37.1 4.51,37.59 U$3.P$37
N$38
  Bottom 0.61: R38.1 4.53,40.13 U$3.P$38
N$39
  Bottom 0.61: R39.1 4.57,42.67 U$3.P$39
N$40
  Bottom 0.61: R40.1 4.61,45.21 U$3.P$40
N$41
  Bottom 0.61: R41.1 4.61,47.5 U$3.P$41
N$42
  Bottom 0.61: R42.1 4.57,50.04 U$3.P$42
N$43
  Bottom 0.61: R43.1 4.53,52.58 U$3.P$43
N$44
  Bottom 0.61: R44.1 4.51,55.12 U$3.P$44
N$45
  Bottom 0.61: R45.1 4.55,57.66 U$3.P$45
N$46
  Bottom 0.61: R46.1 4.59,60.2 U$3.P$46
N$47
  Bottom 0.61: R47.1 4.38,62.48 | 3.81,62.48 4.38,62.48 | 4.38,62.48 U$3.P$47
N$48
  Bottom 0.61: R48.1 4.58,65.02 U$3.P$48
N$49
  Bottom 0.61: R49.1 4.54,67.56 U$3.P$49
N$50
  Bottom 0.61: R50.1 U$3.P$50
N$51
  Top 0.406: R1.1 52.85,70.1 U$1.P$1
  Bottom 0.406: U$1.P$1 54.93,70.67 56.39,72.14 59.18,72.14 65.02,77.98 JP2.1
N$52
  Top 0.406: R2.1 52.85,67.56 U$1.P$2
  Bottom 0.406: JP2.3 65.02,75.44 58.93,69.34 56.39,69.34 55.12,68.07 53.34,68.07 U$1.P$2
N$53
  Top 0.305: JP2.5 69.6,74.17 72.64,74.17 75.95,77.47 R67.1
  Top 0.406: R3.1 52.85,65.02 U$1.P$3
  Bottom 0.406: JP2.5 65.02,72.9 58.93,66.8 56.39,66.8 55.12,65.53 53.85,65.53 53.59,65.79 U$1.P$3
N$54
  Top 0.305: R66.1 76.2,76.2 71.63,71.63 69.6,71.63 JP2.7
  Top 0.406: R4.1 52.83,62.48 53.34,62.97 U$1.P$4
  Bottom 0.406: JP2.7 65.02,70.36 58.93,64.26 56.39,64.26 55.12,62.99 53.59,62.99 53.59,63.25 U$1.P$4
N$55
  Top 0.305: R65.1 76.71,74.93 72.39,70.61 72.39,69.85 71.63,69.09 69.6,69.09 JP2.9
  Top 0.406: R5.1 53.1,60.2 U$1.P$5
  Bottom 0.406: JP2.9 65.02,67.82 58.93,61.72 56.39,61.72 55.12,60.45 53.34,60.45 U$1.P$5
N$56
  Top 0.305: R64.1 76.96,73.66 72.14,68.83 72.14,67.06 71.63,66.55 69.6,66.55 JP2.11
  Top 0.406: R6.1 53.1,57.66 U$1.P$6
  Bottom 0.406: JP2.11 65.02,65.28 58.93,59.18 56.39,59.18 55.12,57.91 53.59,57.91 U$1.P$6
N$57
  Top 0.305: R63.1 76.45,72.39 72.64,68.58 72.64,66.55 72.14,66.04 72.14,64.52 71.63,64.01 69.6,64.01 JP2.13
  Top 0.406: R7.1 53.1,55.12 U$1.P$7
  Bottom 0.406: JP2.13 65.02,62.74 58.93,56.64 56.39,56.64 55.12,55.37 53.59,55.37 53.59,55.63 U$1.P$7
N$58
  Top 0.305: R62.1 75.95,71.12 73.15,68.33 73.15,66.29 72.64,65.79 72.64,64.01 72.14,63.5 72.14,61.98 71.63,61.47 69.6,61.47 JP2.15
  Top 0.406: U$1.P$8 53.1,52.58 R8.1
  Bottom 0.406: JP2.15 65.02,60.2 58.93,54.1 56.39,54.1 55.12,52.83 53.59,52.83 U$1.P$8
N$59
  Top 0.305: R61.1 75.44,69.85 73.66,68.07 73.66,66.04 73.15,65.53 73.15,63.75 72.64,63.25 72.64,59.94 71.63,58.93 69.6,58.93 JP2.17
  Top 0.406: U$1.P$9 53.1,50.04 R9.1
  Bottom 0.406: JP2.17 65.02,57.66 58.93,51.56 56.39,51.56 55.12,50.29 53.59,50.29 U$1.P$9
N$60
  Top 0.305: R60.1 74.93,68.58 74.17,67.82 74.17,65.79 73.66,65.28 73.66,63.5 73.15,62.99 73.15,59.69 72.14,58.67 72.14,56.9 71.63,56.39 69.6,56.39 JP1.1
  Top 0.406: U$1.P$10 53.1,47.5 R10.1
  Bottom 0.406: JP1.1 65.02,55.12 58.93,49.02 56.39,49.02 55.12,47.75 53.34,47.75 U$1.P$10
N$61
  Top 0.305: R59.1 73.41,51.82 71.37,53.85 69.6,53.85 JP1.3
  Top 0.406: U$1.P$11 53.36,45.21 R11.1
  Bottom 0.406: JP1.3 65.02,52.58 58.93,46.48 56.39,46.48 55.12,45.21 53.85,45.21 53.59,45.47 U$1.P$11
N$62
  Top 0.305: R58.1 73.15,49.78 71.63,51.31 69.6,51.31 JP1.5
  Top 0.406: U$1.P$12 53.36,42.67 R12.1
  Bottom 0.406: JP1.5 65.02,50.04 58.93,43.94 56.39,43.94 55.12,42.67 53.59,42.67 53.59,42.93 U$1.P$12
N$63
  Top 0.305: R57.1 72.39,47.75 71.37,48.77 69.6,48.77 JP1.7
  Top 0.406: U$1.P$13 53.36,40.13 R13.1
  Bottom 0.406: JP1.7 65.02,47.5 58.93,41.4 56.39,41.4 55.12,40.13 53.59,40.13 53.59,40.39 U$1.P$13
N$64
  Top 0.305: R56.1 72.14,45.72 71.63,46.23 69.6,46.23 JP1.9
  Top 0.406: U$1.P$14 53.36,37.59 R14.1
  Bottom 0.406: JP1.9 65.02,44.96 58.93,38.86 56.39,38.86 55.12,37.59 53.59,37.59 53.59,37.85 U$1.P$14
N$65
  Top 0.305: R55.1 69.6,43.69 JP1.11
  Top 0.406: U$1.P$15 53.36,35.05 R15.1
  Bottom 0.406: JP1.11 65.02,42.42 58.93,36.32 56.39,36.32 55.12,35.05 53.59,35.05 53.59,35.31 U$1.P$15
N$66
  Top 0.305: R54.1 72.14,41.66 71.63,41.15 69.6,41.15 JP1.13
  Top 0.406: U$1.P$16 53.36,32.51 R16.1
  Bottom 0.406: JP1.13 65.02,39.88 58.93,33.78 56.39,33.78 55.12,32.51 53.59,32.51 53.59,32.77 U$1.P$16
N$67
  Top 0.305: R53.1 72.64,39.62 71.63,38.61 69.6,38.61 JP1.15
  Top 0.406: U$1.P$17 53.36,29.97 R17.1
  Bottom 0.406: JP1.15 65.02,37.34 58.93,31.24 56.39,31.24 55.12,29.97 53.85,29.97 53.59,30.23 U$1.P$17
N$68
  Top 0.406: U$1.P$18 53.36,27.43 R18.1
N$69
  Top 0.406: U$1.P$19 53.23,25.15 R19.1
N$70
  Top 0.406: U$1.P$20 53.23,22.61 R20.1
N$71
  Top 0.406: U$1.P$21 53.23,20.07 R21.1
N$72
  Top 0.406: U$1.P$22 53.23,17.53 R22.1
N$73
  Top 0.406: U$1.P$23 53.23,14.99 R23.1
N$74
  Top 0.406: U$1.P$24 53.23,12.45 R24.1
N$75
  Top 0.406: U$1.P$25 52.97,10.16 R25.1
N$76
  Bottom 0.406: R49.2 51.31,67.56 52.07,66.8 55.12,66.8 56.39,68.07 58.36,68.07 U$1.P$49 58.42,68.33 58.93,68.07 65.02,74.17 68.83,74.17 70.1,75.44 JP2.4
N$77
  Bottom 0.406: R50.2 51.31,70.1 52.07,69.34 55.12,69.34 56.39,70.61 58.36,70.61 U$1.P$50 58.93,70.67 64.96,76.71 68.83,76.71 70.1,77.98 JP2.2
N$78
  Bottom 0.305: R72.1 71.63,73.66 JP2.6
  Bottom 0.406: R48.2 51.31,65.02 52.07,64.26 55.12,64.26 56.39,65.53 58.36,65.53 U$1.P$48 58.42,65.79 58.93,65.53 65.02,71.63 68.83,71.63 70.1,72.9 JP2.6
N$79
  Bottom 0.305: R73.1 73.15,72.64 JP2.8
  Bottom 0.406: R47.2 51.05,62.48 51.82,61.72 55.12,61.72 56.39,62.99 58.36,62.99 U$1.P$47 58.42,63.25 58.93,62.99 65.02,69.09 68.83,69.09 70.1,70.36 JP2.8
N$80
  Bottom 0.305: R74.1 73.91,71.63 72.39,70.1 72.39,69.34 JP2.10
  Bottom 0.406: R46.2 51.56,60.2 52.58,59.18 55.12,59.18 56.39,60.45 58.36,60.45 U$1.P$46 58.42,60.45 58.93,60.45 65.02,66.55 68.83,66.55 70.1,67.82 JP2.10
N$81
  Bottom 0.305: R75.1 74.93,70.61 72.39,68.07 72.39,66.8 JP2.12
  Bottom 0.406: R45.2 51.05,57.66 52.07,56.64 55.12,56.64 56.39,57.91 58.36,57.91 U$1.P$45 58.42,58.17 58.93,57.91 65.02,64.01 68.83,64.01 70.1,65.28 JP2.12
N$82
  Bottom 0.305: R76.1 74.68,69.34 72.9,67.56 72.9,64.77 JP2.14
  Bottom 0.406: R44.2 51.31,55.12 52.32,54.1 55.12,54.1 56.39,55.37 58.36,55.37 U$1.P$44 58.42,55.63 58.93,55.37 65.02,61.47 68.83,61.47 70.1,62.74 JP2.14
N$83
  Bottom 0.305: R77.1 74.42,67.56 73.41,66.55 73.41,62.74 JP2.16
  Bottom 0.406: R43.2 51.05,52.58 52.07,51.56 55.12,51.56 56.39,52.83 58.36,52.83 U$1.P$43 58.42,53.09 58.93,52.83 65.02,58.93 68.83,58.93 70.1,60.2 JP2.16
N$84
  Bottom 0.305: R78.1 74.42,66.04 73.91,65.53 73.91,61.98 72.39,60.45 72.39,59.18 JP2.18
  Bottom 0.406: R42.2 51.05,50.04 52.07,49.02 55.12,49.02 56.39,50.29 58.36,50.29 U$1.P$42 58.42,50.55 58.93,50.29 65.02,56.39 68.83,56.39 70.1,57.66 JP2.18
N$85
  Bottom 0.305: R79.1 74.93,64.52 74.42,64.01 74.42,61.47 72.9,59.94 72.9,58.93 72.39,58.42 72.39,56.64 JP1.2
  Bottom 0.406: R41.2 51.05,47.5 52.07,46.48 55.12,46.48 56.39,47.75 58.36,47.75 U$1.P$41 58.42,48.01 58.93,47.75 65.02,53.85 68.83,53.85 70.1,55.12 JP1.2
N$86
  Bottom 0.305: 71.12,52.32 JP1.4 72.14,53.85 72.14,55.37 72.9,56.13 72.9,58.17 73.41,58.67 73.41,59.44 74.68,60.71 R80.1
  Bottom 0.406: R40.2 51.05,45.21 52.32,43.94 55.12,43.94 56.39,45.21 58.36,45.21 U$1.P$40 58.42,45.47 58.93,45.21 65.02,51.31 68.83,51.31 70.1,52.58 JP1.4
N$87
  Bottom 0.305: R81.1 74.17,59.18 73.91,58.93 73.91,58.42 73.41,57.91 73.41,55.88 72.64,55.12 72.64,53.09 72.14,52.58 72.14,51.31 JP1.6
  Bottom 0.406: R39.2 51.05,42.67 52.32,41.4 55.12,41.4 56.39,42.67 58.36,42.67 U$1.P$39 58.42,42.93 58.93,42.67 65.02,48.77 68.83,48.77 70.1,50.04 JP1.6
N$88
  Bottom 0.305: R82.1 74.17,57.66 73.91,57.4 73.91,55.63 73.15,54.86 73.15,52.83 72.64,52.32 72.64,50.8 72.14,50.29 72.14,48.77 JP1.8
  Bottom 0.406: R38.2 51.05,40.13 52.32,38.86 55.12,38.86 56.39,40.13 58.36,40.13 U$1.P$38 58.42,40.39 58.93,40.13 65.02,46.23 68.83,46.23 70.1,47.5 JP1.8
N$89
  Bottom 0.305: R83.1 74.68,56.13 74.42,55.88 74.42,55.37 73.66,54.61 73.66,52.58 73.15,52.07 73.15,50.55 72.64,50.04 72.64,46.74 JP1.10
  Bottom 0.406: R37.2 51.05,37.59 52.32,36.32 55.12,36.32 56.39,37.59 58.36,37.59 U$1.P$37 58.42,37.85 58.93,37.59 65.02,43.69 68.83,43.69 70.1,44.96 JP1.10
N$90
  Bottom 0.305: R84.1 74.68,54.61 74.17,54.1 74.17,52.32 73.66,51.82 73.66,50.29 73.15,49.78 73.15,45.97 72.14,44.96 72.14,43.69 JP1.12
  Bottom 0.406: R36.2 51.05,35.05 52.32,33.78 55.12,33.78 56.39,35.05 58.36,35.05 U$1.P$36 58.42,35.31 58.93,35.05 65.02,41.15 68.83,41.15 70.1,42.42 JP1.12
N$91  (via drill 0.5 pad 1)
  Top 0.305: v73.15,38.1 73.66,38.61 76.96,38.61 77.47,38.1 78.09,38.1 U$2.43
  Top 0.406: R69.1 78.23,26.42 77.89,26.76 R68.1 77.89,28.11 v78.99,29.21
  Bottom 0.305: 75.69,29.46 75.69,35.31 74.42,36.58 73.41,36.58 72.9,37.08 72.9,37.85 v73.15,38.1
  Bottom 0.406: v78.99,29.21 75.95,29.21 75.69,29.46
N$92
  Bottom 0.305: R86.1 75.18,51.56 74.68,51.05 74.68,49.78 74.17,49.28 74.17,45.47 73.15,44.45 73.15,42.93 72.64,42.42 72.64,39.12 JP1.16
  Bottom 0.406: R34.2 51.05,29.97 52.32,28.7 55.12,28.7 56.39,29.97 58.36,29.97 U$1.P$34 58.42,30.23 58.93,29.97 65.02,36.07 68.83,36.07 70.1,37.34 JP1.16
N$93
  Bottom 0.406: R33.2 51.05,27.43 52.32,26.16 57.09,26.16 U$1.P$33
N$94
  Bottom 0.406: R32.2 51.05,25.15 52.58,23.62 57.09,23.62 U$1.P$32
N$95
  Bottom 0.406: R31.2 50.8,22.61 52.32,21.08 57.09,21.08 U$1.P$31
N$96
  Bottom 0.406: R30.2 51.05,20.07 52.58,18.54 57.09,18.54 U$1.P$30
N$97
  Bottom 0.406: R29.2 51.05,17.53 52.58,16 57.09,16 U$1.P$29
N$98
  Bottom 0.406: R28.2 51.05,14.99 52.58,13.46 57.09,13.46 U$1.P$28
N$99
  Bottom 0.406: R27.2 51.05,12.45 52.58,10.92 57.09,10.92 U$1.P$27
N$100
  Bottom 0.406: R26.2 50.29,10.16 52.32,8.13 56.83,8.13 U$1.P$26
N$101
  Bottom 0.813: JP3.1 JP5.2
N$102
  Bottom 0.61: JP3.2 68.58,1.52 70.1,3.05 74.93,3.05 JP4.2
N$103  (via drill 0.5 pad 1)
  Top 0.305: U$2.44 74.44,37.61 v74.42,37.59 | v84.07,26.92 R52.2 82.64,26.76 81.79,25.91 80.26,25.91 80.01,25.65 80.01,24.3 Q2.3
  Bottom 0.305: v74.42,37.59 75.44,37.59 77.22,35.81 77.22,32.77 78.99,30.99 80.01,30.99 81.28,29.72 81.28,27.69 82.04,26.92 v84.07,26.92
N$104
  Top 0.406: LED1.A 77.98,22.61 78.23,22.86 R69.2
N$105
  Bottom 0.305: R85.1 74.93,53.09 74.68,52.83 74.68,52.07 74.17,51.56 74.17,50.04 73.66,49.53 73.66,45.72 72.64,44.7 72.64,43.18 72.14,42.67 72.14,41.15 JP1.14
  Bottom 0.406: JP1.14 70.1,39.88 69.09,38.61 65.02,38.61 58.93,32.51 58.67,32.77 58.42,32.51 | 58.42,32.51 U$1.P$35 | 58.42,32.51 56.39,32.51 55.12,31.24 52.07,31.24 50.8,32.51 R35.2
N$106
  Top 0.305: U$2.49 78.04,35.13 76.96,35.13 76.54,34.63 R51.2 76.2,29.12
  Top 0.406: Q1.3 76.28,28.28 76.45,28.45 76.45,29.38 R51.2
N$107  (via drill 0.5 pad 1)
  Top 0.406: LED7.C 98.03,36.84 v98.04,36.83
  Bottom 0.406: v98.04,36.83 R90.1
N$109  (via drill 0.5 pad 1)
  Top 0.406: LED6.C 98.03,34.3 v98.04,34.29
  Bottom 0.406: v98.04,34.29 R89.1
N$111  (via drill 0.5 pad 1)
  Top 0.406: LED5.C 98.03,31.76 v98.04,31.75
  Bottom 0.406: v98.04,31.75 R88.1
N$116
  Top 0.406: LED2.C 82.05,4.56 81.28,5.33 81.28,7.11 81.03,7.37 R70.1
OSC_OUT
  Top 0.305: OS1.3 83.06,18.8 85.34,21.08 85.34,32.85 U$2.62
RPI_CE#
  Top 0.305: JP3.24 68.33,29.46 69.34,28.45 72.39,28.45 73.41,29.46 R51.1
RPI_CLKOUT
  Top 0.305: JP3.7 84.84,9.4 87.63,11.68 87.63,26.16 88.65,27.18 88.65,28.7 87.63,29.72 85.85,31.75 U$2.63
RPI_GPIO24
  Top 0.305: Q2.1 81.35,22.93 79.25,20.83 69.6,20.83 JP3.18
RPI_GPIO25
  Top 0.305: Q1.1 72.83,26.86 71.88,25.91 69.6,25.91 JP3.22
RPI_MISO  (via drill 0.5 pad 1)
  Top 0.305: U$2.45 75.46,37.11 v73.91,35.56
  Bottom 0.305: 70.87,27.43 JP3.21 72.9,29.21 72.9,34.29 73.91,35.31 v73.91,35.56
RPI_MOSI  (via drill 0.5 pad 1)
  Top 0.305: U$2.46 76.49,36.61 74.42,34.54 v74.42,32.51
  Bottom 0.305: v74.42,32.51 74.42,31.75 73.91,31.24 73.91,27.69 JP3.19
RPI_SCLK
  Top 0.305: JP3.23 72.39,29.72 73.41,30.73 74.93,30.73 75.69,31.5 75.69,34.8 76.43,35.61 78.03,35.61 U$2.48
SLOT_0
  Top 0.305: R67.2 95,77.47 97.03,75.44 97.03,52.32 98.3,51.05 98.3,42.42 97.54,41.66 93.67,41.6 U$2.90
SLOT_1
  Top 0.305: R66.2 94.74,76.2 96.01,74.93 96.01,52.58 97.79,50.8 97.79,42.67 97.28,42.16 93.66,42.11 U$2.91
SLOT_2
  Top 0.305: R65.2 91.44,74.93 92.99,73.51 92.96,68.1 95.25,65.79 95.25,52.58 97.28,50.55 97.28,44.12 96.77,43.61 93.66,43.61 U$2.94
SLOT_3
  Top 0.305: R64.2 90.68,73.66 92.2,72.14 92.2,68.07 94.74,65.53 94.74,52.32 96.77,50.29 96.77,44.35 96.52,44.09 93.69,44.09 U$2.95
SLOT_4
  Top 0.305: R63.2 86.87,72.39 88.39,70.87 88.39,68.58 89.15,67.82 91.69,67.82 94.23,65.28 94.23,52.07 96.27,50.04 96.27,45.36 96.01,45.11 93.7,45.11 U$2.97
SLOT_5
  Top 0.305: R62.2 87.12,71.12 87.88,70.36 87.88,68.33 88.9,67.31 91.44,67.31 93.73,65.02 93.73,51.82 95.76,49.78 95.76,47.75 94.21,46.1 93.69,46.1 U$2.99
SLOT_6
  Top 0.305: R61.2 86.61,69.85 87.38,69.09 87.38,68.07 88.65,66.8 91.19,66.8 93.22,64.77 93.22,47 U$2.100
SLOT_7
  Top 0.305: R60.2 86.11,68.58 88.39,66.29 90.93,66.29 92.71,64.52 92.71,48.71 U$2.1
SLOT_8
  Top 0.305: R59.2 76.96,51.82 77.98,50.8 77.98,46.74 U$2.26
SLOT_9
  Top 0.305: U$2.27 77.33,46.11 77.22,46.23 77.22,48.35 R58.2
SLOT_10
  Top 0.305: R57.2 75.78,47.66 76.71,46.74 76.71,45.97 76.94,45.62 77.97,45.62 U$2.28
SLOT_11
  Top 0.305: R56.2 75.95,45.72 76.43,45.11 77.98,45.11 U$2.29
SLOT_12
  Top 0.305: R55.2 76.96,43.69 77.22,43.94 77.22,44.6 77.69,44.6 U$2.30
SLOT_13
  Top 0.305: U$2.36 75.82,41.61 R54.2
SLOT_14
  Top 0.305: R53.2 76.45,39.62 76.96,40.13 76.96,40.64 77.42,41.1 78.02,41.1 U$2.37
SLOT_15  (via drill 0.5 pad 1)
  Top 0.305: v84.35,51.54 U$2.16
  Bottom 0.305: R86.2 v84.35,51.54
SLOT_16  (via drill 0.5 pad 1)
  Top 0.305: v83.31,53.09 83.06,52.83 83.06,51.56 83.36,51.23 83.36,48.33 U$2.18
  Bottom 0.305: R85.2 v83.31,53.09
SLOT_17  (via drill 0.5 pad 1)
  Top 0.305: v82.55,54.61 81.79,53.85 81.79,52.07 82.85,51.03 82.85,48.38 U$2.19
  Bottom 0.305: R84.2 v82.55,54.61
SLOT_18  (via drill 0.5 pad 1)
  Top 0.305: U$2.20 82.37,48.37 82.37,50.75 81.03,52.07 81.03,55.88 81.28,56.13 v81.79,56.13
  Bottom 0.305: R83.2 v81.79,56.13
SLOT_19  (via drill 0.5 pad 1)
  Top 0.305: U$2.21 81.86,48.38 81.86,50.49 80.01,52.32 80.01,57.15 80.52,57.66 v80.77,57.66
  Bottom 0.305: R82.2 v80.77,57.66
SLOT_20  (via drill 0.5 pad 1)
  Top 0.305: U$2.24 80.37,48.42 80.37,51.03 79.25,52.07 79.25,58.67 79.76,59.18 v80.01,59.18
  Bottom 0.305: R81.2 v80.01,59.18
SLOT_21  (via drill 0.5 pad 1)
  Top 0.305: U$2.25 79.86,48.46 79.86,50.8 78.23,52.32 78.23,60.2 78.74,60.71 v79.25,60.71
  Bottom 0.305: R80.2 v79.25,60.71
SLOT_22  (via drill 0.5 pad 1)
  Top 0.305: v86.36,51.56 U$2.12
  Bottom 0.305: R79.2 82.8,64.52 83.57,63.75 83.57,56.64 86.36,53.85 v86.36,51.56
SLOT_23  (via drill 0.5 pad 1)
  Top 0.305: v85.85,55.88 85.85,53.59 87.35,52.07 87.35,48.38 U$2.10
  Bottom 0.305: R78.2 83.06,66.04 84.07,65.02 84.07,57.66 v85.85,55.88
SLOT_24  (via drill 0.5 pad 1)
  Top 0.305: v85.85,57.66 86.36,57.66 86.87,57.15 86.87,53.34 87.86,52.3 87.86,48.39 U$2.9
  Bottom 0.305: R77.2 83.31,67.56 84.58,66.29 84.58,58.93 v85.85,57.66
SLOT_25  (via drill 0.5 pad 1)
  Top 0.305: v85.85,59.69 85.85,59.18 87.38,57.66 87.38,53.59 88.34,52.6 88.34,48.4 U$2.8
  Bottom 0.305: R76.2 84.33,69.34 85.09,68.58 85.09,60.45 v85.85,59.69
SLOT_26  (via drill 0.5 pad 1)
  Top 0.305: U$2.7 88.85,48.41 88.85,53.09 87.88,54.1 87.88,57.91 87.12,58.67 87.12,60.45 v86.11,61.72
  Bottom 0.305: R75.2 85.09,70.61 86.11,69.6 v86.11,61.72
SLOT_27  (via drill 0.5 pad 1)
  Top 0.305: v90.35,50.8 90.35,48.43 U$2.4
  Bottom 0.305: R74.2 86.11,71.63 87.12,70.61 87.12,53.85 90.17,50.8 v90.35,50.8
SLOT_28  (via drill 0.5 pad 1)
  Top 0.305: v90.93,52.32 90.93,51.56 91.44,51.05 91.44,50.29 90.86,49.81 90.86,48.47 U$2.3
  Bottom 0.305: R73.2 87.63,72.64 87.63,54.36 89.66,52.32 v90.93,52.32
SLOT_29  (via drill 0.5 pad 1)
  Top 0.305: v91.19,53.85 91.19,53.59 91.95,52.83 91.95,49.53 91.36,49.02 91.36,48.32 U$2.2
  Bottom 0.305: R72.2 87.63,73.66 88.14,73.15 88.14,54.86 89.15,53.85 v91.19,53.85
V1V2  (via drill 0.5 pad 1)
  Top 0.305: 80.29,42.11 78.18,42.11 U$2.35 | 86.87,46.99 86.87,48.35 U$2.11 | U$2.77 92.65,35.11 92.2,35.56 | v85.6,36.07 85.34,36.07 84.84,35.56 84.84,32.88 U$2.61 84.84,32.84 84.84,32 84.58,31.75 84.07,31.75 83.75,31.43 C11.1
  Top 0.406: v85.6,42.16 83.82,42.16 83.31,42.67 80.77,42.67 80.29,42.11 | v86.87,42.16 86.87,43.43 87.88,44.45 87.88,45.97 86.87,46.99 | v85.6,36.07 91.69,36.07 92.2,35.56 | LED3.A 86.12,6.11 v87.88,7.87
  Bottom 0.305: C12.1 85.6,39.12 C13.1 | C10.1 85.6,21.84
  Bottom 0.406: v87.88,7.87 86.63,7.87 U$5.2
  Bottom 0.813: U$5.2 86.01,8.95 | 85.6,30.99 v85.6,36.07 85.6,39.12 v85.6,42.16 v86.87,42.16 86.29,42.74 C15.1
  Bottom 1.016: U$5.2 85.85,8.79 85.85,10.41 84.49,11.78 C3.+ 84.49,16.92 85.6,18.03 85.6,21.84 85.6,30.99

### Text on the board
tPlace: JAN MARJANOVIC, 2015 | JAN MARJANOVIC, 2015 | MARJANOVIC / 2015
bPlace: JAN MARJANOVIC, 2015